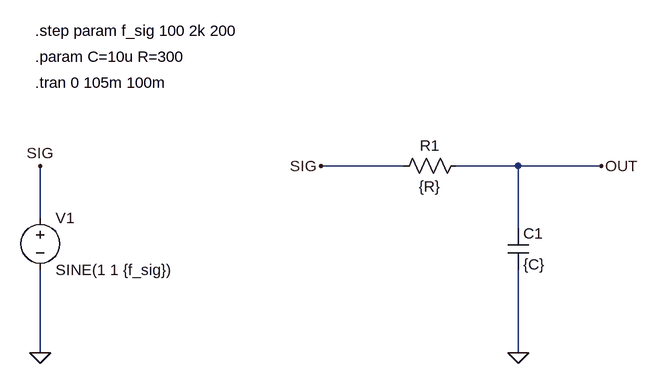
[diagram p0: schematic LPF_RC_step_f_sig.asc]
LPF_RC_step_f_sig.asc, the LTspice schematic file:
Version 4
SHEET 1 880 680
WIRE -160 -128 -288 -128
WIRE 16 -128 -80 -128
WIRE 144 -128 16 -128
WIRE -720 -48 -720 -128
WIRE 16 -32 16 -128
WIRE -720 160 -720 32
WIRE 16 160 16 32
FLAG -288 -128 SIG
FLAG 16 160 0
FLAG -720 -128 SIG
FLAG -720 160 0
FLAG 144 -128 OUT
SYMBOL res -176 -112 R270
WINDOW 0 32 56 VTop 2
WINDOW 3 0 56 VBottom 2
SYMATTR InstName R1
SYMATTR Value {R}
SYMBOL cap 0 -32 R0
SYMATTR InstName C1
SYMATTR Value {C}
SYMBOL voltage -720 -64 R0
WINDOW 123 0 0 Left 2
WINDOW 39 0 0 Left 2
SYMATTR InstName V1
SYMATTR Value SINE(1 1 {f_sig})
TEXT -728 -336 Left 2 !.step param f_sig 100 2k 200
TEXT -728 -296 Left 2 !.param C=10u R=300
TEXT -728 -256 Left 2 !.tran 0 105m 100m

The netlist it stands for:
* LPF_RC_step_f_sig.asc
R1 SIG OUT {R}
C1 OUT 0 {C}
V1 SIG 0 SINE(1 1 {f_sig})
.step param f_sig 100 2k 200
.param C=10u R=300
.tran 0 105m 100m
.backanno
.end

* Results of the author's LTspice run, read from the files saved beside the schematic
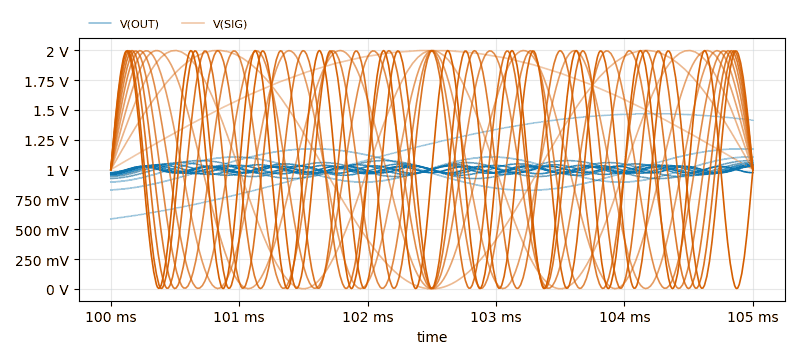
[diagram p1: Transient Analysis of LPF_RC_step_f_sig.asc, plotted from the saved traces]
* Transient Analysis, 21 runs:
*   V(OUT) [run 1]: min 586.1 mV, max 1.468 V, average 1.14 V, rms 1.179 V, last 1.414 V
*   V(OUT) [run 2]: 829 mV at time=100 ms, 829 mV at time=100 ms, min 829 mV, max 829 mV
*   V(OUT) [run 3]: min 826.4 mV, max 1.174 V, average 1.007 V, rms 1.014 V, last 1.172 V
*   V(OUT) [run 4]: min 894.9 mV, max 1.106 V, average 1.002 V, rms 1.004 V, last 1.105 V
*   V(OUT) [run 5]: 925.2 mV at time=100 ms, 925.2 mV at time=100 ms, min 925.2 mV, max 925.2 mV
*   V(OUT) [run 6]: min 924.8 mV, max 1.076 V, average 1.001 V, rms 1.002 V, last 1.075 V
*   V(OUT) [run 7]: min 941.6 mV, max 1.059 V, average 1.001 V, rms 1.001 V, last 1.059 V
*   V(OUT) [run 8]: 952.3 mV at time=100 ms, 952.3 mV at time=100 ms, min 952.3 mV, max 952.3 mV
*   V(SIG) [run 1]: min 1 V, max 1.998 V, average 1.636 V, rms 1.665 V, last 1 V
*   V(SIG) [run 2]: 1 V at time=100 ms, 1 V at time=100 ms, min 1 V, max 1 V
*   V(SIG) [run 3]: min 523.9 µV, max 2 V, average 1.212 V, rms 1.387 V, last 1 V
*   V(SIG) [run 4]: min 1.455 mV, max 1.998 V, average 1.127 V, rms 1.324 V, last 1 V
*   V(SIG) [run 5]: 1 V at time=100 ms, 1 V at time=100 ms, min 1 V, max 1 V
*   V(SIG) [run 6]: min 1.947 mV, max 1.998 V, average 1.091 V, rms 1.296 V, last 1 V
*   V(SIG) [run 7]: min 2.697 mV, max 1.997 V, average 1.07 V, rms 1.28 V, last 1 V
*   V(SIG) [run 8]: 1 V at time=100 ms, 1 V at time=100 ms, min 1 V, max 1 V